# Altium schematic sheet outgoing connection.SchDoc
size A4
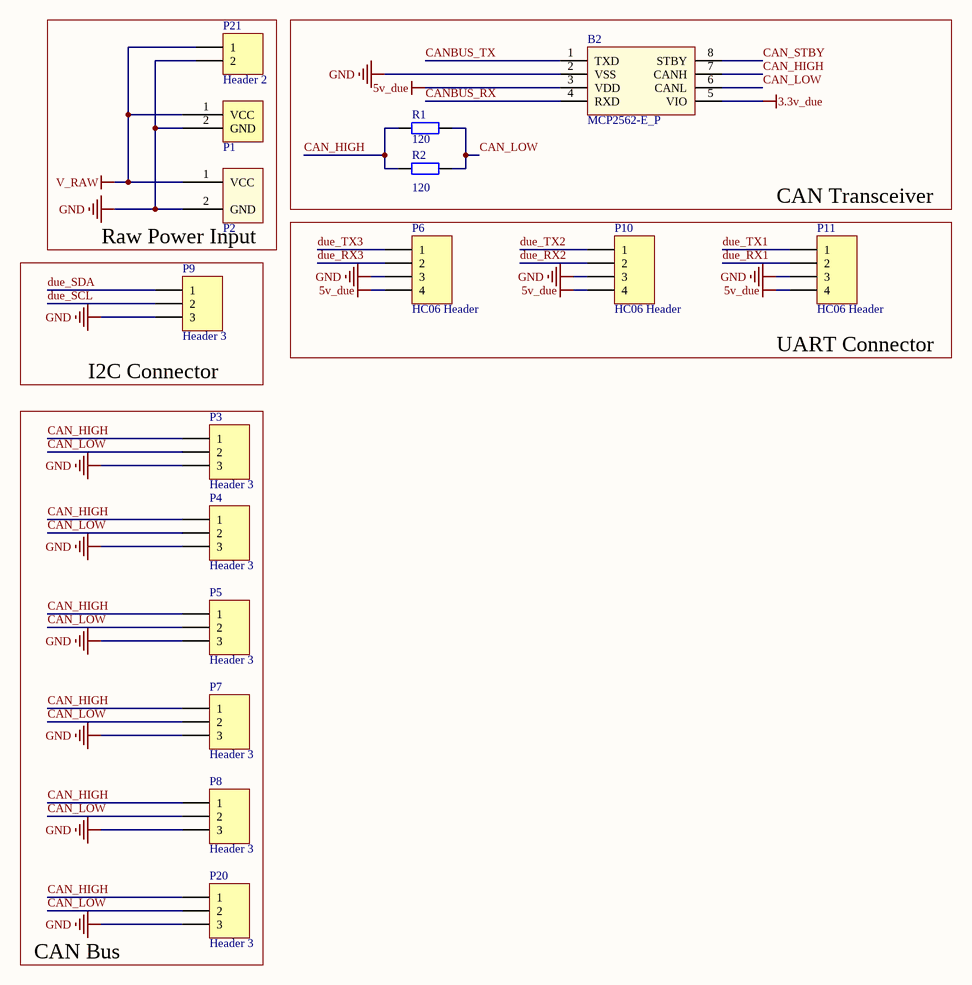
[diagram p0: outgoing connection.SchDoc]

## Parts
B2  MCP2562-E_P  [DIP781W56P254L950H533Q8N]
P1  5557 Connector  [5557_connector]  (value not drawn)
P2  big Pin power port  [bigPin_power_port]  (value not drawn)
P3  Header 3  [HDR1X3]
P4  Header 3  [HDR1X3]
P5  Header 3  [HDR1X3]
P6  HC06 Header  [HDR1X4]
P7  Header 3  [HDR1X3]
P8  Header 3  [HDR1X3]
P9  Header 3  [HDR1X3]
P10  HC06 Header  [HDR1X4]
P11  HC06 Header  [HDR1X4]
P20  Header 3  [HDR1X3]
P21  Header 2  [HDR1X2]
R1  value 120  [AXIAL-0.4]  (hidden comment: Res2)
R2  value 120  [AXIAL-0.4]  (hidden comment: Res2)

## Nets
3.3v_due: B2.5(VIO)
5v_due: B2.3(VDD) P6.4 P10.4 P11.4
GND: B2.2(VSS) P1.2(GND) P2.2(GND) P3.3 P4.3 P5.3 P6.3 P7.3 P8.3 P9.3 P10.3 P11.3 P20.3 P21.2
V_RAW: P1.1(VCC) P2.1(VCC) P21.1
CAN_HIGH: B2.7(CANH) P3.1 P4.1 P5.1 P7.1 P8.1 P20.1 R1.1 R2.1
CAN_LOW: B2.6(CANL) P3.2 P4.2 P5.2 P7.2 P8.2 P20.2 R1.2 R2.2
CAN_STBY: B2.8(STBY)
CANBUS_RX: B2.4(RXD)
CANBUS_TX: B2.1(TXD)
due_RX1: P11.2
due_RX2: P10.2
due_RX3: P6.2
due_SCL: P9.2
due_SDA: P9.1
due_TX1: P11.1
due_TX2: P10.1
due_TX3: P6.1

## Notes on the sheet
- (near P11) CAN Transceiver
- (near P2) Raw Power Input
- (near P11) UART Connector
- I2C Connector
- (near P20) CAN Bus Connector

## Library data of the parts
B2 = MCP2562-E_P: CAN Transceiver 1Mbps 5V 125degC PDIP8 Microchip MCP2562-E/P, CAN Transceiver 1-channel IEC 61000-4-2, 8-Pin PDIP; Geometry.Height: 5.334mm; Supplier_Name: RS; RS Part Number: 7990225; Manufacturer_Name: Microchip; Manufacturer_Part_Number: MCP2562-E/P; Allied_Number: *; Other Part Number: *; Datasheet Link: http://uk.rs-online.com/webdocs/1380/0900766b81380aaf.pdf; 3D Package: *
P1 = 5557_connector
P3-P5 P7-P9 P20 = Header 3: Header, 3-Pin; LatestRevisionDate: 17-Jul-2002; LatestRevisionNote: Re-released for DXP Platform.; Publisher: Altium Limited
P6 P10 P11 = Header 4: Header, 4-Pin; LatestRevisionDate: 17-Jul-2002; LatestRevisionNote: Re-released for DXP Platform.; Publisher: Altium Limited
P21 = Header 2: Header, 2-Pin; LatestRevisionDate: 17-Jul-2002; LatestRevisionNote: Re-released for DXP Platform.; Publisher: Altium Limited
R1 R2 = Res2: Resistor; Published: 8-Jun-2000; LatestRevisionDate: 17-Jul-2002; LatestRevisionNote: Re-released for DXP Platform.; PackageReference: AXIAL-0.4; Publisher: Altium Limited; PackageDescription: Axial Device, Thru-Hole; 2 Leads; 0.4 in Pin Spacing